# EasyEDA Pro project minSTMc8t6.eprj

# Schematic Schematic1
Create Date: 2024-05-14; Page Name: P1; Project Name: M.2_minSTMc8t6; Schematic Name: Schematic1; Update Date: 2024-05-14; Company: 嘉立创EDA; Page Size: A3; Version: V1.0
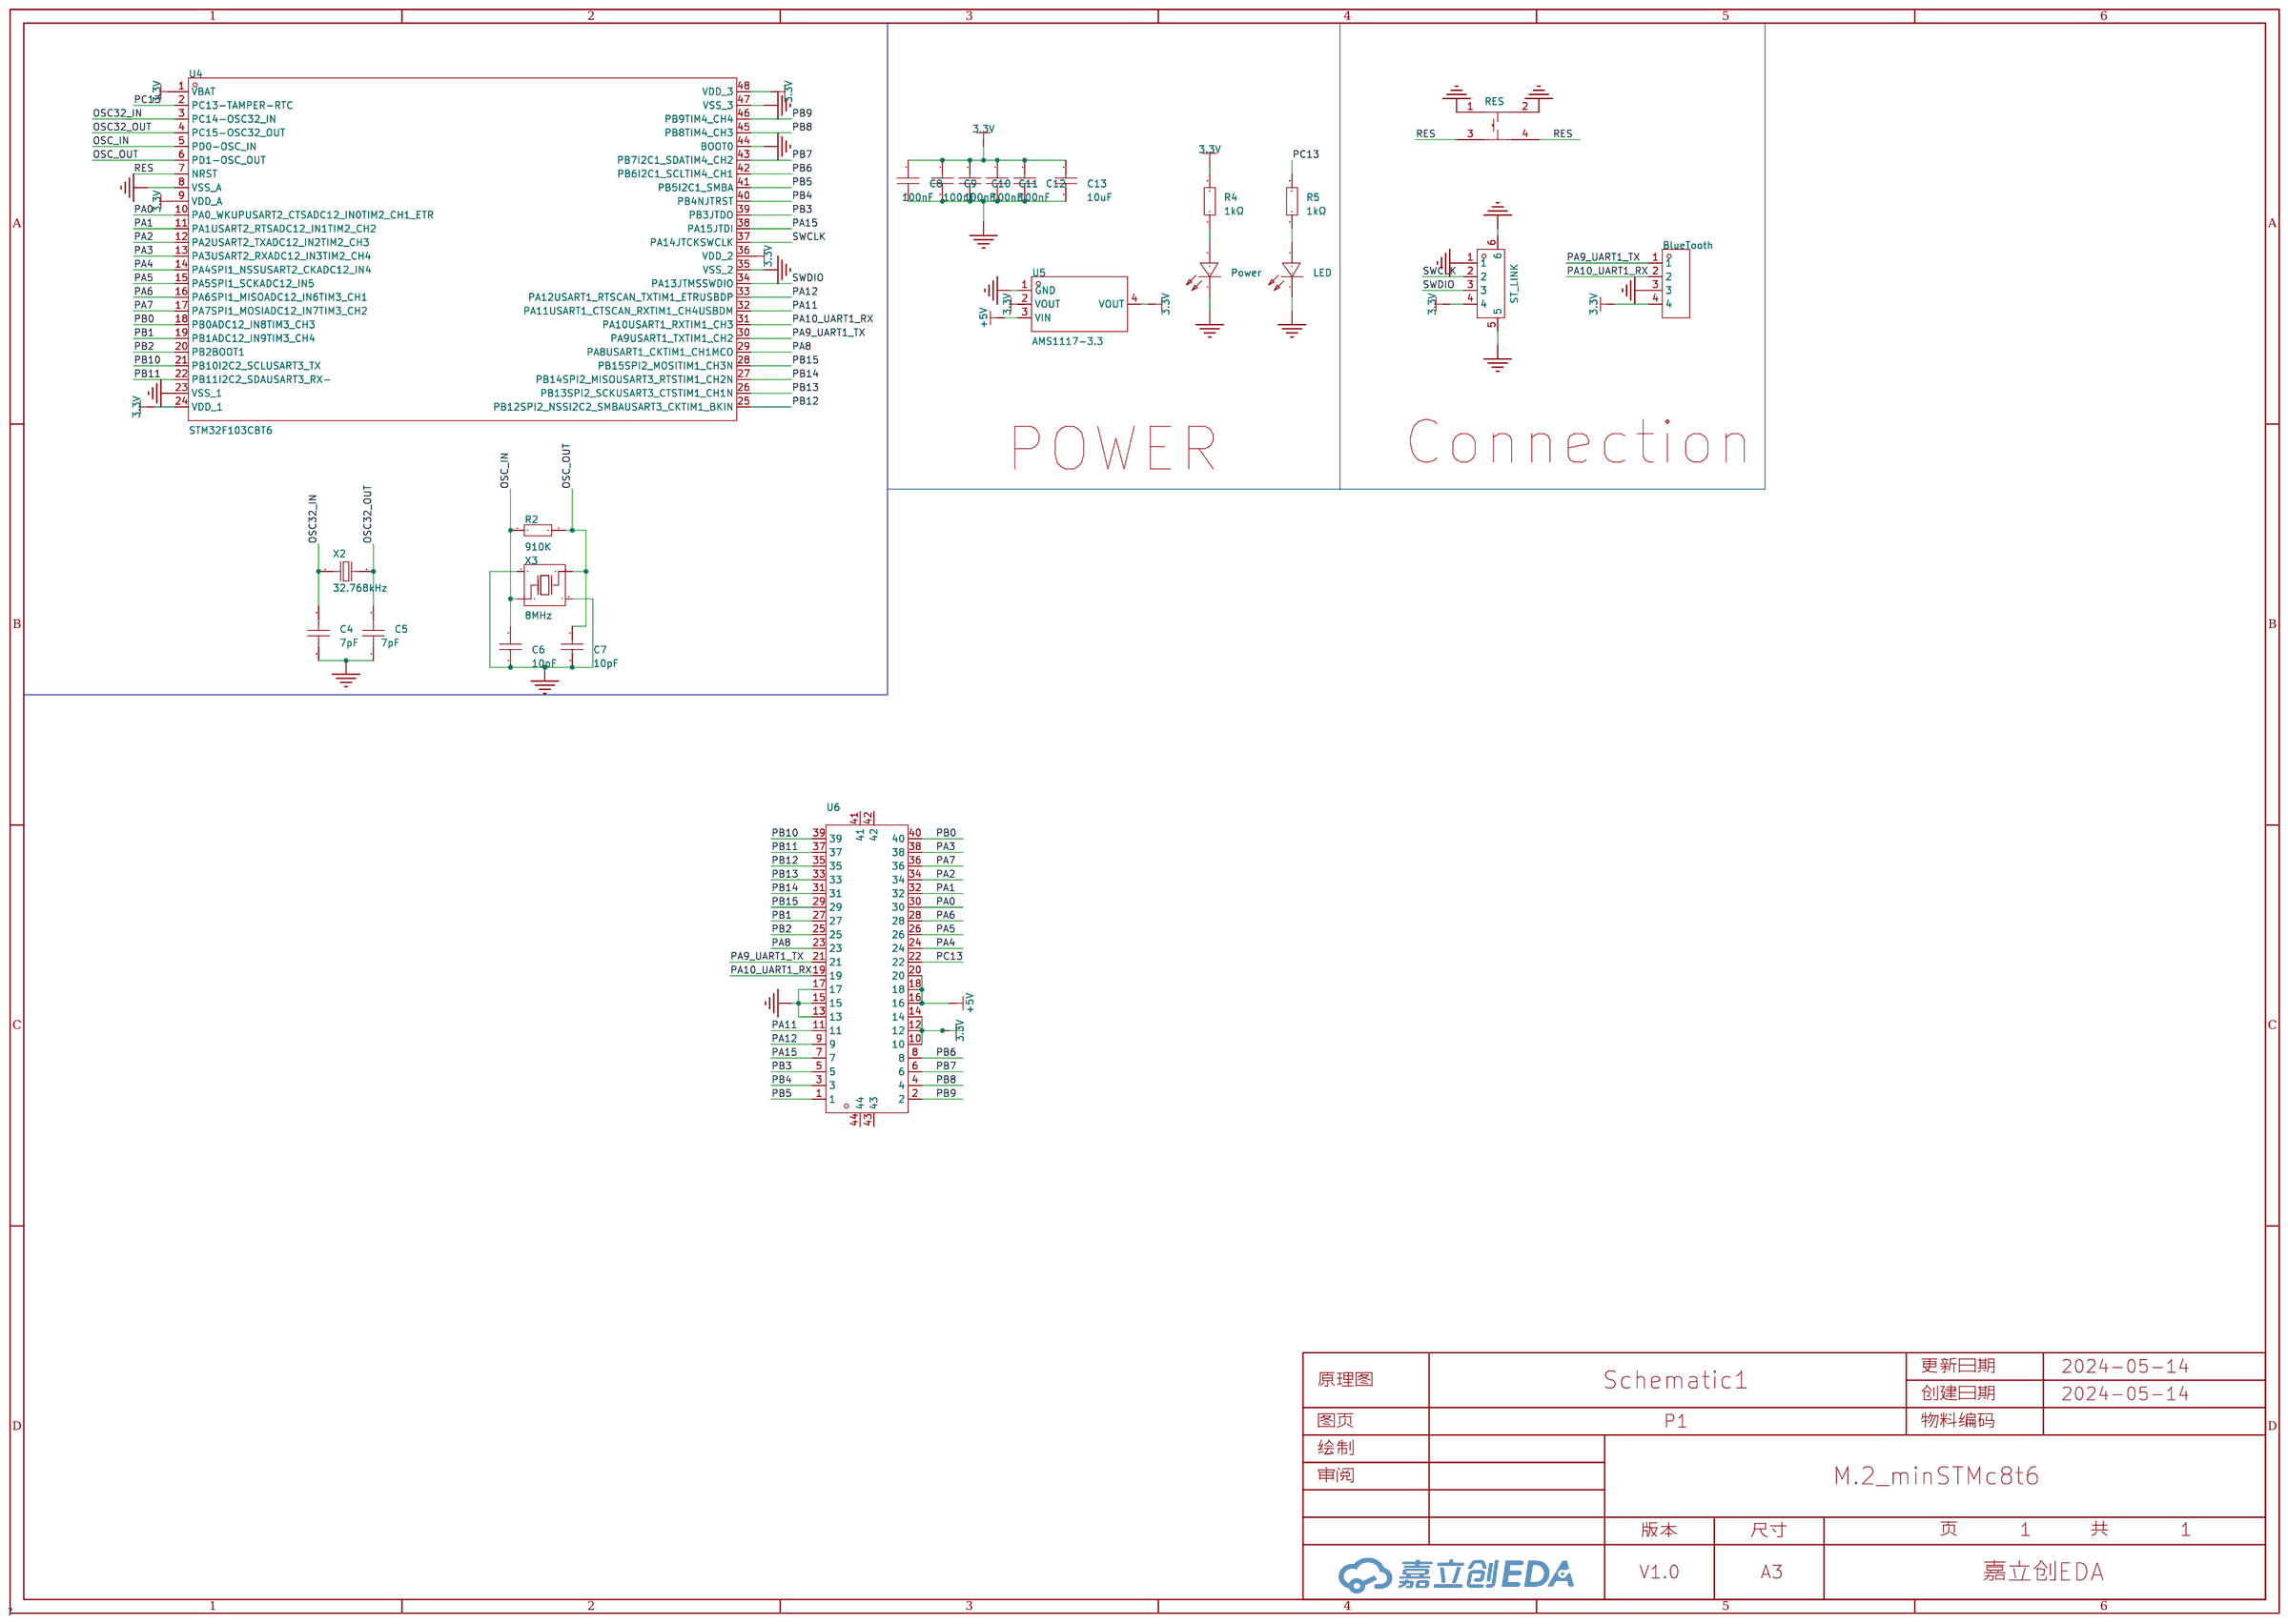
[diagram p0: schematic sheet]

## Parts
BlueTooth  2.54-1*4P母  [HDR-TH_4P-P2.54-V-F]
C4  7pF  [C0402]
C5  7pF  [C0402]
C6  10pF  [C0402]
C7  10pF  [C0402]
C8  100nF  [C0402]
C9  100nF  [C0402]
C10  100nF  [C0402]
C11  100nF  [C0402]
C12  100nF  [C0402]
C13  10uF  [C0402]
LED  NCD0402R1  [LED0402-RD]
Power  NCD0402R1  [LED0402-RD]
R2  910K  [R0603]
R4  1kΩ  [R0402]
R5  1kΩ  [R0402]
RES  K2-1808SN-A3SW-01  [SW-SMD_4P-L4.2-W3.3-P2.15-LS5.1]
ST_LINK  HDGC1251WR-S-4P  [CONN-SMD_4P-P1.25_HDGC-HDGC1251WR-S-4P]
U4  STM32F103CBT6  [LQFP-48_L7.0-W7.0-P0.50-LS9.0-BL]
U5  AMS1117-3.3  [SOT-223-3_L6.5-W3.4-P2.30-LS7.0-BR]
U6  HC-PBB40C-40DP-0.4V-02  [CONN-SMD_40P-P0.40_HCTL_HC-PBB40C-40DP-0.4V-02]
X2  32.768kHz  [FC-135R_L3.2-W1.5]
X3  8MHz  [OSC-SMD_4P-L3.2-W2.5-BL]

## Library data of the parts
BlueTooth = 2.54-1*4P母: 插孔结构:1x4P;间距:2.54mm;行距:-;圆孔/方孔:方孔;安装类型:直插;排数:单排;总孔位数:4P;额定电流:3A;额定电压:-;插孔方向:顶部;塑高:-;触头材质:青铜;触头镀层:-;工作温度范围:-40℃~+105℃;焊接温度(最大值):-;; LCSC Part Name: 间距:2.54mm 1x4P 直插; Supplier Part: C2718488; Manufacturer: BOOMELE(博穆精密); Supplier Footprint: 插件,P=2.54mm; JLCPCB Part Class: 扩展库; Datasheet: https://atta.szlcsc.com/upload/public/pdf/source/20210301/C2718488_F4427B881E42CAA8DDB0B1C12B3A522C.pdf; Supplier: LCSC; Holes Structure: 1x4P; Pitch: 2.54mm; Circular Hole / Square Hole: 方孔; Mounting Type: 直插; Number of Rows: 单排; Number of Holes: 4P; Current Rating (Max): 3A; Holes Direction: 顶部; Contact Material: 青铜; Operating Temperature Range: -40℃~+105℃
C4 C5 = CC0402BRNPO9BN7R0: 容值:7pF;额定电压:50V;材质(温度系数):NP0;; LCSC Part Name: 7pF 50V; Supplier Part: C541343; Manufacturer: YAGEO(国巨); Supplier Footprint: 0402; JLCPCB Part Class: 扩展库; Datasheet: https://atta.szlcsc.com/upload/public/pdf/source/20200615/C541343_829EF09E97ECA25D4EF5AFDE43440985.pdf; Supplier: LCSC; Voltage Rated: 50V; Temperature Coefficient: NP0
C6 C7 = CC0402JRNPO9BN100: 容值:10pF;精度:±5%;额定电压:50V;材质(温度系数):NP0;; LCSC Part Name: 10pF ±5% 50V; Supplier Part: C106199; Manufacturer: YAGEO(国巨); Supplier Footprint: 0402; JLCPCB Part Class: Extended Part; Datasheet: https://atta.szlcsc.com/upload/public/pdf/source/20181008/C309499_21CC21451B82C39E3D92150FD6B30293.pdf; Supplier: LCSC; Tolerance: ±5%; Voltage Rated: 50V; Temperature Coefficient: NP0
C8-C12 = CL05B104KO5NNNC: 容值:100nF;精度:±10%;额定电压:16V;材质(温度系数):X7R;; LCSC Part Name: 100nF ±10% 16V; Supplier Part: C1525; Manufacturer: SAMSUNG(三星); Supplier Footprint: 0402; JLCPCB Part Class: 基础库; Datasheet: https://atta.szlcsc.com/upload/public/pdf/source/20160218/1457707763339.pdf; Supplier: LCSC; Tolerance: ±10%; Voltage Rated: 16V; Temperature Coefficient: X7R
C13 = CL05A106MQ5NUNC: 容值:10uF;精度:±20%;额定电压:6.3V;材质(温度系数):X5R;; LCSC Part Name: 10uF ±20% 6.3V; Supplier Part: C15525; Manufacturer: SAMSUNG(三星); Supplier Footprint: 0402; JLCPCB Part Class: Basic Part; Datasheet: https://atta.szlcsc.com/upload/public/pdf/source/20220823/2B02EE04F8F211D38A52DCB16EB6BEBA.pdf; Supplier: LCSC; Tolerance: ±20%; Voltage Rated: 6.3V; Temperature Coefficient: X5R
LED Power = NCD0402R1: 发光颜色:红色;正向电压(VF):1.6V~2.6V;功率:65mW;正向电流:5mA;主波长:615nm~635nm;透镜颜色:无色透明透镜;发光强度:13mcd~30mcd;发光角度:130°;工作温度:-30℃~+85℃;; Supplier Part: C130719; Manufacturer: 国星光电; Supplier Footprint: 0402; JLCPCB Part Class: Extended Part; Datasheet: https://atta.szlcsc.com/upload/public/pdf/source/20200820/C130719_A72EA5A7FEC83C35856EA0453E4EE775.pdf; Supplier: LCSC; Emitted Color: 红色; Forward Voltage (VF): 1.6V~2.6V; Power Dissipation: 65mW; Forward Current: 5mA; Dominant Wavelength: 615nm~635nm; Lens Color: 无色透明透镜; Luminous Intensity: 13mcd~30mcd; Viewing Angle: 130°; Operating Temperature: -30℃~+85℃
R2 = Res_0603: Supplier Footprint: 0603
R4 R5 = 0402WGF1001TCE: 电阻类型:厚膜电阻;阻值:1kΩ;精度:±1%;功率:62.5mW;最大工作电压:50V;温度系数:±100ppm/℃;; LCSC Part Name: 1kΩ ±1% 62.5mW 厚膜电阻; Supplier Part: C11702; Manufacturer: UNI-ROYAL(厚声); Supplier Footprint: 0402; JLCPCB Part Class: 基础库; Datasheet: https://atta.szlcsc.com/upload/public/pdf/source/20200306/C422600_1E6D84923E4A46A82E41ADD87F860B5C.pdf; Supplier: LCSC; Type: 厚膜电阻; Tolerance: ±1%; Power(Watts): 62.5mW; Overload Voltage (Max): 50V; Temperature Coefficient: ±100ppm/℃; Operating Temperature Range: -55℃~+155℃
RES = K2-1808SN-A3SW-01: 作用力:180gf;安装方式:立贴;开关长度:4.2mm;开关宽度:3.25mm;开关高度:2.5mm;触点电流:50mA;额定电压(DC):12V;绝缘电阻:100MΩ;机械寿命:10万次;; LCSC Part Name: 3*4*2.5 贴片开关180G; Supplier Part: C2690012; Manufacturer: 韩国韩荣; Supplier Footprint: SMD; JLCPCB Part Class: 扩展库; Datasheet: https://atta.szlcsc.com/upload/public/pdf/source/20180927/C283535_7E7907F3E7B6C1691E1DC87E363D082A.pdf; Supplier: LCSC; Operating Force: 180gf; Mounting Style: 立贴; Switch Length: 4.2mm; Switch Width: 3.25mm; Switch Height: 2.5mm; Contact Current: 50mA; Voltage Rating (DC): 12V; Insulation Resistance: 100MΩ; Mechanical Life: 10万次; Operating Temperature: -25℃~+85℃
ST_LINK = HDGC1251WR-S-4P: 插针结构:1x4P;间距:1.25mm;安装方式:卧贴;参考系列:-;总PIN数:4P;排数:1;每排PIN数:4;行距:-;额定电流:1A;工作温度范围:-25℃~+70℃;; LCSC Part Name: 1x4P 间距:1.25mm 卧贴; Supplier Part: C2936205; Manufacturer: HDGC(华德共创); Supplier Footprint: SMD,P=1.25mm,卧贴; JLCPCB Part Class: 扩展库; Datasheet: https://atta.szlcsc.com/upload/public/pdf/source/20211224/39B2CD9909BA84C441A1A286C5C28FE5.pdf; Supplier: LCSC; Pins Structure: 1x4P; Pitch: 1.25mm; Mounting Style: 卧贴; Number of Pins: 4P; Number of Rows: 1; Number of PINs Per Row: 4; Current Rating (Max): 1A; Operating Temperature Range: -25℃~+70℃
U4 = STM32F103CBT6: CPU内核:CM3;程序存储容量:128KB;RAM总容量:20KB;GPIO端口数量:37;工作电压范围:2V~3.6V;CPU最大主频:72MHz;程序存储器类型:FLASH;; Supplier Part: C8304; Manufacturer: ST(意法半导体); Supplier Footprint: LQFP-48(7x7); JLCPCB Part Class: 扩展库; Datasheet: https://atta.szlcsc.com/upload/public/pdf/source/20150811/1457707344439.pdf; Supplier: LCSC; CPU Core: CM3; Program Storage Size: 128KB; RAM Size: 20KB; GPIO Ports Number: 37; Operating Voltage Range: 2V~3.6V; CPU Maximum Speed: 72MHz; Program Memory Type: FLASH; Operating Temperature Range: -40℃~+85℃; ADC (Bit): 12bit; Universal Serial Bus: 有; Peripheral/Function: DMA；片载温度传感器；PWM; Watchdog: 有; Infrared Data Association: 有; Low-Voltage Detect: 有; Direct Memory Access: 有; Internal Oscillator: 有; Check: true
U5 = AMS1117-3.3_C6186: 输出类型:固定;最大输入电压:-;输出电压:3.3V;最大输出电流:1A;电源纹波抑制比(PSRR):72dB@(120Hz);输出极性:正极;; LCSC Part Name: 输出3.3V 1A; Supplier Part: C6186; Manufacturer: AMS; Supplier Footprint: SOT-223-3; JLCPCB Part Class: 基础库; Datasheet: https://atta.szlcsc.com/upload/public/pdf/source/20180727/C6186_7A095716F0823C02F1997A905E26C086.pdf; Supplier: LCSC; Output Type: 固定; Output Voltage: 3.3V; MAX Output Current: 1A; Power Supply Rejection Ratio (PSRR): 72dB@(120Hz); Dropout Voltage: 1.3V@(800mA); Output Polarity: 正极; Number of Outputs: 1
U6 = HC-PBB40C-40DP-0.4V-02: PIN总数:40P;间距:0.4mm;公母:公;安装方式:立贴;行数:2;额定电流:300mA;工作温度范围:-35℃~+85℃;; LCSC Part Name: PIN:40P 间距:0.4mm 公 立贴; Supplier Part: C19089232; Manufacturer: HCTL(华灿天禄); Supplier Footprint: SMD,P=0.4mm; JLCPCB Part Class: 扩展库; Datasheet: https://atta.szlcsc.com/upload/public/pdf/source/20231026/4BDE2190AA6E7694F187A7FBDCD76BE9.pdf; Supplier: LCSC; Number of Pins: 40P; Pitch: 0.4mm; Gender: 公; Mounting Style: 立贴; Number of Rows: 2; Current Rating (Max): 300mA; Contact Material: 磷青铜; Operating Temperature Range: -35℃~+85℃
X2 = Q13FC13500004_C32346: 晶振类型:贴片晶振;频率:32.768kHz;常温频差:±20ppm;外接负载电容:12.5pF;; LCSC Part Name: 32.768kHz ±20ppm 12.5pF; Supplier Part: C32346; Manufacturer: EPSON(爱普生); Manufacturer Part: Q13FC13500004; Supplier Footprint: SMD3215-2P; JLCPCB Part Class: 基础库; Datasheet: https://atta.szlcsc.com/upload/public/pdf/source/20240418/0E0FF5F0356BA3753F616001439D1416.pdf; Supplier: LCSC; Crystal Type: 贴片晶振; Normal temperature Frequency Tolerance: ±20ppm; External load capacitor: 12.5pF; Equivalent Series Resistance (ESR): 70kΩ; Operating Temperature: -40℃~+85℃
X3 = TAXM8M4RDBCCT2T: 晶振类型:贴片晶振;频率:8MHz;常温频差:±10ppm;外接负载电容:10pF;频率稳定度(全温):±15ppm;; LCSC Part Name: 8MHz ±10ppm 10pF; Supplier Part: C400090; Manufacturer: YJX(雅晶鑫); Supplier Footprint: SMD3225-4P; JLCPCB Part Class: 扩展库; Datasheet: https://atta.szlcsc.com/upload/public/pdf/source/20190626/C400090_CF95B89E745AFE4EF2E392EF8AC009D6.pdf; Supplier: LCSC; Crystal Type: 贴片晶振; Normal temperature Frequency Tolerance: ±10ppm; External load capacitor: 10pF; Frequency Stability(Full temperature range): ±15ppm; Equivalent Series Resistance (ESR): 250Ω; Operating Temperature: -40℃~+85℃

## Nets
3.3V: BlueTooth.4 C8.2 C9.2 C10.2 C11.2 C12.2 C13.2 R4.2 ST_LINK.4 U4.1(VBAT) U4.9(VDD_A) U4.24(VDD_1) U4.36(VDD_2) U4.48(VDD_3) U5.2(VOUT) U5.4(VOUT) U6.10 U6.12 U6.14
+5V: U5.3(VIN) U6.16 U6.18 U6.20
GND: BlueTooth.3 C4.1 C5.1 C6.1 C7.1 C8.1 C9.1 C10.1 C11.1 C12.1 C13.1 LED.1(K) Power.1(K) RES.1 RES.2 ST_LINK.1 ST_LINK.5 ST_LINK.6 U4.8(VSS_A) U4.23(VSS_1) U4.35(VSS_2) U4.44(BOOT0) U4.47(VSS_3) U5.1(GND) U6.13 U6.15 U6.17 X3.2 X3.4
OSC32_IN: C4.2 U4.3(PC14-OSC32_IN) X2.1
OSC32_OUT: C5.2 U4.4(PC15-OSC32_OUT) X2.2
OSC_IN: C6.2 R2.1 U4.5(PD0-OSC_IN) X3.1
OSC_OUT: C7.2 R2.2 U4.6(PD1-OSC_OUT) X3.3
PA0: U4.10(PA0_WKUPUSART2_CTSADC12_IN0TIM2_CH1_ETR) U6.30
PA1: U4.11(PA1USART2_RTSADC12_IN1TIM2_CH2) U6.32
PA2: U4.12(PA2USART2_TXADC12_IN2TIM2_CH3) U6.34
PA3: U4.13(PA3USART2_RXADC12_IN3TIM2_CH4) U6.38
PA4: U4.14(PA4SPI1_NSSUSART2_CKADC12_IN4) U6.24
PA5: U4.15(PA5SPI1_SCKADC12_IN5) U6.26
PA6: U4.16(PA6SPI1_MISOADC12_IN6TIM3_CH1) U6.28
PA7: U4.17(PA7SPI1_MOSIADC12_IN7TIM3_CH2) U6.36
PA8: U4.29(PA8USART1_CKTIM1_CH1MCO) U6.23
PA9_UART1_TX: BlueTooth.1 U4.30(PA9USART1_TXTIM1_CH2) U6.21
PA10_UART1_RX: BlueTooth.2 U4.31(PA10USART1_RXTIM1_CH3) U6.19
PA11: U4.32(PA11USART1_CTSCAN_RXTIM1_CH4USBDM) U6.11
PA12: U4.33(PA12USART1_RTSCAN_TXTIM1_ETRUSBDP) U6.9
PA15: U4.38(PA15JTDI) U6.7
PB0: U4.18(PB0ADC12_IN8TIM3_CH3) U6.40
PB1: U4.19(PB1ADC12_IN9TIM3_CH4) U6.27
PB2: U4.20(PB2BOOT1) U6.25
PB3: U4.39(PB3JTDO) U6.5
PB4: U4.40(PB4NJTRST) U6.3
PB5: U4.41(PB5I2C1_SMBA) U6.1
PB6: U4.42(PB6I2C1_SCLTIM4_CH1) U6.8
PB7: U4.43(PB7I2C1_SDATIM4_CH2) U6.6
PB8: U4.45(PB8TIM4_CH3) U6.4
PB9: U4.46(PB9TIM4_CH4) U6.2
PB10: U4.21(PB10I2C2_SCLUSART3_TX) U6.39
PB11: U4.22(PB11I2C2_SDAUSART3_RX-) U6.37
PB12: U4.25(PB12SPI2_NSSI2C2_SMBAUSART3_CKTIM1_BKIN) U6.35
PB13: U4.26(PB13SPI2_SCKUSART3_CTSTIM1_CH1N) U6.33
PB14: U4.27(PB14SPI2_MISOUSART3_RTSTIM1_CH2N) U6.31
PB15: U4.28(PB15SPI2_MOSITIM1_CH3N) U6.29
PC13: R5.2 U4.2(PC13-TAMPER-RTC) U6.22
RES: RES.3 RES.4 U4.7(NRST)
SWCLK: ST_LINK.2 U4.37(PA14JTCKSWCLK)
SWDIO: ST_LINK.3 U4.34(PA13JTMSSWDIO)
$1N3567: Power.2(A) R4.1
$1N4136: LED.2(A) R5.1

Not connected (* = marked no-connect by the designer): U6 41 42 43 44

## Notes on the sheet
- Connection
- POWER

# Board PCB1
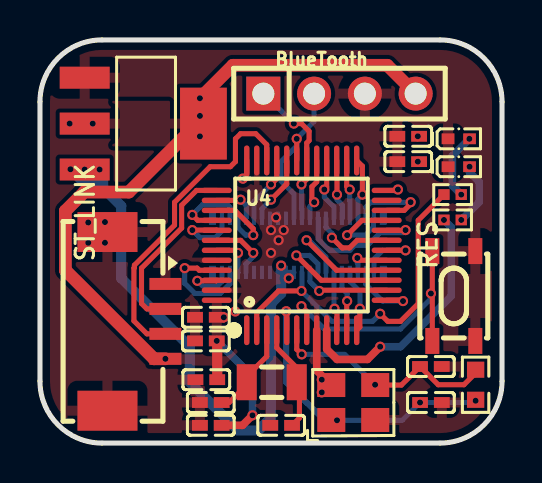
[diagram p1: board, top side]
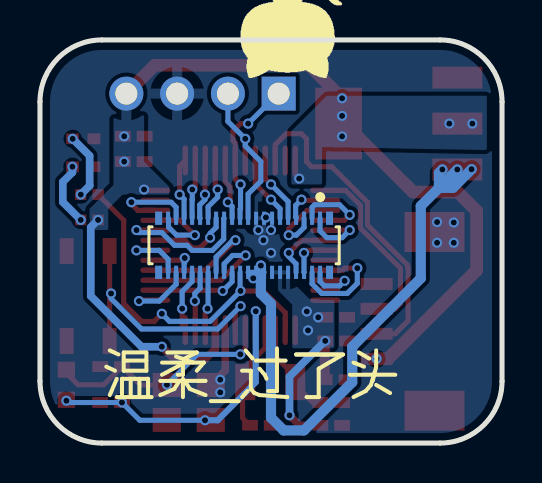
[diagram p2: board, bottom side, seen from below]

Outline 23.11 x 20.19 mm; copper layers: Top Layer, Bottom Layer. Coordinates in mm from the lower left corner of the outline.
Outline path: 0,17.09 0,3.1 arc(0.91,0.91) 3.1,0 20.01,0 arc(22.21,0.91) 23.11,3.1 23.11,17.09 arc(22.21,19.29) 20.01,20.19 3.1,20.19 arc(0.91,19.29) 0,17.09
Stack: Top Layer 0.035mm / Dielectric1 1.51mm FR4 er 4.5 / Bottom Layer 0.035mm

## Design rules (mm)
template: 自定义配置
spacing copperThickness1oz (default): track to track 0.102, other pairs 0.152 to 0.3
spacing copperThickness2oz: track to track 0.203, other pairs 0.152 to 0.3
track width copperThickness1oz (default): min 0.127, default 0.254, max 2.54
track width copperThickness2oz: min 0.203, default 0.254, max 2.54
differential pair differentialPair (default): width min 0.127, default 0.254, max 2.54; gap min 0.152, default 0.152
via viaSize (default): diameter min 0.5, default 0.61, max 10; hole min 0.3, default 0.305, max 6.3

## Placement (name value [footprint] x y rotation side)
BlueTooth  2.54-1*4P母  [HDR-TH_4P-P2.54-V-F]  14.98 17.5 0 top
C4  7pF  [C0402]  8.54 2.03 0 top
C5  7pF  [C0402]  12.06 0.89 0 top
C6  10pF  [C0402]  19.56 2.03 180 top
C7  10pF  [C0402]  19.56 3.83 180 top
C8  100nF  [C0402]  8.32 3.18 0 top
C9  100nF  [C0402]  8.3 6.3 0 top
C10  100nF  [C0402]  8.3 5.12 0 top
C11  100nF  [C0402]  8.54 0.89 0 top
C12  100nF  [C0402]  18.42 14.1 0 top
C13  10uF  [C0402]  18.42 15.37 0 top
LED  NCD0402R1  [LED0402-RD]  20.95 15.24 0 top
Power  NCD0402R1  [LED0402-RD]  20.95 13.84 0 top
R2  910K  [R0603]  21.79 2.92 90 top
R4  1kΩ  [R0402]  20.64 11.18 180 top
R5  1kΩ  [R0402]  20.64 12.45 180 top
RES  K2-1808SN-A3SW-01  [SW-SMD_4P-L4.2-W3.3-P2.15-LS5.1]  20.7 7.37 270 top
ST_LINK  HDGC1251WR-S-4P  [CONN-SMD_4P-P1.25_HDGC-HDGC1251WR-S-4P]  4.83 6.1 270 top
U4  STM32F103CBT6  [LQFP-48_L7.0-W7.0-P0.50-LS9.0-BL]  13.09 9.91 0 top
U5  AMS1117-3.3  [SOT-223-3_L6.5-W3.4-P2.30-LS7.0-BR]  5.21 16 180 top
U6  HC-PBB40C-40DP-0.4V-02  [CONN-SMD_40P-P0.40_HCTL_HC-PBB40C-40DP-0.4V-02]  12.9 9.91 0 bottom
X2  32.768kHz  [FC-135R_L3.2-W1.5]  11.59 3.05 0 top
X3  8MHz  [OSC-SMD_4P-L3.2-W2.5-BL]  15.67 2.03 0 top

## Footprints (pads in the part's own frame, mm; a bottom-side part is the same pattern mirrored in y, then rotated)
C0402
  rect 0.79x0.54 smd: 1(-0.545,0) 2(0.545,0)
CONN-SMD_4P-P1.25_HDGC-HDGC1251WR-S-4P
  rect 0.6x1.6 smd: 1(-1.875,1.45) 2(-0.625,1.45) 3(0.625,1.45) 4(1.875,1.45)
  rect 2x3 smd: 5(4.475,-1.45) 6(-4.475,-1.45)
CONN-SMD_40P-P0.40_HCTL_HC-PBB40C-40DP-0.4V-02
  rect 0.2x0.66 smd: 1(-3.8,-1.355) 2(-3.8,1.355) 3(-3.4,-1.355) 4(-3.4,1.355) 5(-3,-1.355) 6(-3,1.355) 7(-2.6,-1.355) 8(-2.6,1.355) 9(-2.2,-1.355) 10(-2.2,1.355) 11(-1.8,-1.355) 12(-1.8,1.355) 13(-1.4,-1.355) 14(-1.4,1.355) 15(-1,-1.355) 16(-1,1.355) 17(-0.6,-1.355) 18(-0.6,1.355) 19(-0.2,-1.355) 20(-0.2,1.355) 21(0.2,-1.355) 22(0.2,1.355) 23(0.6,-1.355) 24(0.6,1.355) 25(1,-1.355) 26(1,1.355) 27(1.4,-1.355) 28(1.4,1.355) 29(1.8,-1.355) 30(1.8,1.355) 31(2.2,-1.355) 32(2.2,1.355) 33(2.6,-1.355) 34(2.6,1.355) 35(3,-1.355) 36(3,1.355) 37(3.4,-1.355) 38(3.4,1.355) 39(3.8,-1.355) 40(3.8,1.355)
  rect 0.35x0.66 smd: 41(4.275,-1.355) 42(4.275,1.355) 43(-4.275,1.355) 44(-4.275,-1.355)
FC-135R_L3.2-W1.5
  rect 1x1.8 smd: 1(-1.25,0) 2(1.25,0)
HDR-TH_4P-P2.54-V-F
  rect 1.7x1.7 hole 1.1: 1(-3.81,0)
  round 1.7 hole 1.1: 2(-1.27,0) 3(1.27,0) 4(3.81,0)
LED0402-RD
  rect 0.636x0.54 smd: 1(-0.538,0) 2(0.538,0)
LQFP-48_L7.0-W7.0-P0.50-LS9.0-BL
  oval 0.27x1.5 smd: 1(-2.75,-4.25) 2(-2.25,-4.25) 3(-1.75,-4.25) 4(-1.25,-4.25) 5(-0.75,-4.25) 6(-0.25,-4.25) 7(0.25,-4.25) 8(0.75,-4.25) 9(1.25,-4.25) 10(1.75,-4.25) 11(2.25,-4.25) 12(2.75,-4.25) 25(2.75,4.25) 26(2.25,4.25) 27(1.75,4.25) 28(1.25,4.25) 29(0.75,4.25) 30(0.25,4.25) 31(-0.25,4.25) 32(-0.75,4.25) 33(-1.25,4.25) 34(-1.75,4.25) 35(-2.25,4.25) 36(-2.75,4.25)
  oval 1.5x0.27 smd: 13(4.25,-2.75) 14(4.25,-2.25) 15(4.25,-1.75) 16(4.25,-1.25) 17(4.25,-0.75) 18(4.25,-0.25) 19(4.25,0.25) 20(4.25,0.75) 21(4.25,1.25) 22(4.25,1.75) 23(4.25,2.25) 24(4.25,2.75) 37(-4.25,2.75) 38(-4.25,2.25) 39(-4.25,1.75) 40(-4.25,1.25) 41(-4.25,0.75) 42(-4.25,0.25) 43(-4.25,-0.25) 44(-4.25,-0.75) 45(-4.25,-1.25) 46(-4.25,-1.75) 47(-4.25,-2.25) 48(-4.25,-2.75)
OSC-SMD_4P-L3.2-W2.5-BL
  rect 1.4x1.2 smd: 1(-1.1,-0.875) 2(1.1,-0.875) 3(1.1,0.875) 4(-1.1,0.875)
R0402
  rect 0.566x0.54 smd: 1(-0.433,0) 2(0.433,0)
R0603
  rect 0.806x0.864 smd: 1(-0.753,0) 2(0.753,0)
SOT-223-3_L6.5-W3.4-P2.30-LS7.0-BR
  rect 2.5x1.1 smd: 1(2.97,-2.3) 2(2.97,0) 3(2.97,2.3)
  rect 2.34x3.6 smd: 4(-2.97,0)
SW-SMD_4P-L4.2-W3.3-P2.15-LS5.1
  rect 1.3x0.7 smd: 1(-2.25,1.075) 2(2.25,1.075) 3(-2.25,-1.075) 4(2.25,-1.075)

## Nets
As in the schematic.

Pads without a net: U6 41 42 43 44

## Via types
v1: diameter 0.508, hole 0.305, Top Layer to Bottom Layer, 78 vias

## Routing (per net, layer and track width the routed paths; a pad name or vN(x,y) marks a point on that pad's centre or on a via; arc(x,y) is an arc through that point)
3.3V: length 52.4
  Top Layer w0.254: v1(10.15,13.25) 10.34,13.44 U4.36
  Top Layer w0.381: v1(10.63,1.39) 10.13,0.89 C11.2 ; 14.34,5.66 14.34,4.71 14.86,4.19 16.38,4.19 v1(17.02,4.83)
  Top Layer w0.508: C8.2 8.87,5.1 v1(8.84,5.12)
  Top Layer w0.635: v1(8,17.27) 9.65,18.92 17.37,18.92 BlueTooth.4 ; v1(6.28,4.22) 5.7,4.22 1.27,8.66 1.27,11.63 2.21,12.57 4.44,12.57 7.87,16 U5.4
  Bottom Layer w0.381: v1(17.02,4.83) 18.03,4.83 20.57,7.37 20.57,10.81 v1(20.21,11.18) ; v1(10.63,1.39) 10.63,3.33 v1(8.84,5.12)
  vias: v1(1.48,16) v1(2.64,16) v1(8,16.39) v1(8,15.36) v1(9.2,6.3) v1(9.7,5.65) v1(9.77,6.59) v1(17.91,12.7) v1(18.9,15.37) v1(18.9,14.1)
+5V: length 29.8
  Bottom Layer w0.254: U6.20 U6.18 U6.16
  Bottom Layer w0.508: v1(1.52,13.72) 2.46,12.78 3.16,12.78 ; v1(2.98,13.7) 3.16,13.53 3.16,12.78 ; 3.16,12.78 4.06,11.88 4.06,8.26 7.49,4.83 7.49,3.05 9.91,0.64 10.92,0.64 11.56,1.27 11.56,6.98 12.06,7.49 v1(12.06,8.89) ; 3.16,12.78 v1(2.24,13.7)
  vias: v1(12.45,8.26)
GND: length 3.1
  Top Layer w0.381: X3.4 13.84,3.64 U4.8
  vias: v1(2.41,11.05) v1(2.41,10.03) v1(3.25,11.07) v1(3.25,10.03) v1(11.56,10.67) v1(11.56,9.53) v1(11.81,11.3) v1(11.94,10.16) v1(12.19,10.67) v1(14.1,3.18) v1(14.1,2.54)
OSC32_IN: length 4.2
  Top Layer w0.254: 10.48,3.05 9.46,2.03 C4.2 ; U4.3 11.34,4.34 10.56,3.56
OSC32_OUT: length 4.9
  Top Layer w0.254: C5.2 12.98,1.26 12.98,3.05 ; 13.06,3.56 11.84,4.77 U4.4
OSC_IN: length 15.2
  Top Layer w0.254: U4.5 12.34,6.58 v1(12.32,6.6)
  Bottom Layer w0.254: v1(14.86,1.14) 18.12,1.14 v1(19.01,2.03) 21.7,2.03 v1(21.79,2.12)
  Bottom Layer w0.305: v1(12.32,6.6) 12.32,3.05 14.22,1.14 v1(14.86,1.14)
OSC_OUT: length 11.8
  Top Layer w0.254: X3.3 18.08,2.91 19.01,3.83 19.92,2.92 21.21,2.92 21.79,3.51 R2.2 ; U4.6 12.84,4.7 v1(13.09,4.45)
  Bottom Layer w0.254: v1(16.76,2.92) 15.24,4.45 v1(13.09,4.45)
PA0: length 2.7
  Top Layer w0.254: 14.86,6.48 14.86,5.67 U4.10
  Bottom Layer w0.254: U6.30 14.7,6.76 v1(14.73,6.73)
PA1: length 3
  Top Layer w0.254: 15.34,5.66 15.34,7.09 v1(15.37,7.11)
  Bottom Layer w0.254: U6.32 15.1,7.76 15.37,7.49 v1(15.37,7.11)
PA2: length 3.2
  Top Layer w0.254: U4.12 16,5.81 v1(16,6.73)
  Bottom Layer w0.254: U6.34 15.5,8.09 16,7.59 v1(16,6.73)
PA3: length 3.6
  Top Layer w0.254: v1(18.16,7.11) 18.12,7.16 17.34,7.16
  Bottom Layer w0.254: v1(18.16,7.11) 17.14,7.11 16.3,7.95 U6.38
PA4: length 4.5
  Top Layer w0.254: 17.34,7.66 14.01,7.66 v1(13.97,7.62)
  Bottom Layer w0.254: v1(13.97,7.62) 13.5,8.09 U6.24
PA5: length 6.7
  Top Layer w0.254: v1(12.83,9.4) 14.07,8.16 17.34,8.16
  Bottom Layer w0.254: v1(12.83,9.4) 13.48,9.4 13.9,8.98 U6.26
PA6: length 6.7
  Top Layer w0.254: 17.34,8.66 14.84,8.66 v1(13.33,10.16)
  Bottom Layer w0.254: v1(13.33,10.16) 13.46,10.16 14.3,9.32 U6.28
PA7: length 2.2
  Top Layer w0.254: v1(15.88,9.27) 15.99,9.16 17.34,9.16
  Bottom Layer w0.254: v1(15.88,9.27) 15.88,9.04 15.9,9.01 U6.36
PA8: length 3.1
  Top Layer w0.254: v1(13.72,12.06) 13.6,12.18 13.6,12.84 13.84,13.08 U4.29
  Bottom Layer w0.254: U6.23 13.5,11.85 v1(13.72,12.06)
PA9_UART1_TX: length 7.6
  Top Layer w0.254: v1(13.08,12.95) 13.34,13.22 U4.30 13.34,15.03 13.46,15.15 13.46,15.62 13.08,16 v1(12.7,16)
  Bottom Layer w0.254: v1(12.7,16) 11.2,17.5 BlueTooth.1 ; v1(13.08,12.95) 13.08,11.74 13.1,11.72 U6.21
PA10_UART1_RX: length 8.3
  Top Layer w0.254: U4.31 v1(12.84,15.24)
  Bottom Layer w0.254: BlueTooth.2 13.71,16.11 v1(12.84,15.24) 12.84,14.88 12.06,14.1 12.06,13.12 12.7,12.48 U6.19
PA11: length 3.4
  Top Layer w0.254: v1(11.56,12.19) 12.34,12.98 U4.32
  Bottom Layer w0.254: U6.11 11.1,11.74 v1(11.56,12.19)
PA12: length 3.4
  Top Layer w0.254: U4.33 11.84,13.24 v1(11.56,12.95)
  Bottom Layer w0.254: U6.9 10.7,12.1 v1(11.56,12.95)
PA15: length 2.3
  Top Layer w0.254: U4.38 10,12.16 v1(10.03,12.19)
  Bottom Layer w0.254: 10.29,11.28 10.32,11.31 10.32,11.9 v1(10.03,12.19)
PB0: length 3.4
  Top Layer w0.254: v1(18.29,9.65) 18.28,9.66 17.34,9.66
  Bottom Layer w0.254: U6.40 16.7,9.21 17.14,9.65 v1(18.29,9.65)
PB1: length 4.2
  Top Layer w0.254: 17.34,10.16 15.86,10.16 15.49,9.78 15.11,9.78 v1(14.6,10.29)
  Bottom Layer w0.254: U6.27 14.3,10.8 14.6,10.5 v1(14.6,10.29)
PB2: length 7
  Top Layer w0.254: v1(18.29,10.67) 18.28,10.66 17.34,10.66
  Bottom Layer w0.254: U6.25 13.92,11.24 13.92,10.21 14.49,9.65 15.5,9.65 15.76,9.91 16.38,9.91 17.02,10.54 18.16,10.54 v1(18.29,10.67)
PB3: length 3.9
  Top Layer w0.254: U4.39 9.75,11.66 10.67,10.74 v1(10.67,10.41)
  Bottom Layer w0.254: v1(10.67,10.41) 10.29,10.41 9.9,10.8 U6.5
PB4: length 4
  Top Layer w0.254: v1(7.62,11.43) 7.89,11.16 U4.40
  Bottom Layer w0.254: U6.3 9.5,11.81 9.38,11.94 8.13,11.94 v1(7.62,11.43)
PB5: length 3.6
  Top Layer w0.254: U4.41 8.83,10.67 v1(7.62,10.67)
  Bottom Layer w0.254: U6.1 9.1,10.63 8.76,10.29 8,10.29 v1(7.62,10.67)
PB6: length 3.2
  Top Layer w0.254: U4.42 10.04,10.16 v1(10.67,9.53)
  Bottom Layer w0.254: U6.8 10.3,8.98 10.67,9.34 v1(10.67,9.53)
PB7: length 2.1
  Top Layer w0.254: v1(9.91,9.53) 9.78,9.66 U4.43
  Bottom Layer w0.254: v1(9.91,9.53) 9.91,8.55 U6.6
PB8: length 5.7
  Top Layer w0.254: v1(7.24,8.76) 7.86,8.76 7.97,8.66 U4.45
  Bottom Layer w0.254: v1(7.24,8.76) 7.24,8 7.75,7.49 9.02,7.49 9.5,7.98 U6.4
PB9: length 2.9
  Top Layer w0.254: U4.46 8.82,8.13 v1(7.87,8.13)
  Bottom Layer w0.254: U6.2 9.1,8.09 8.89,7.87 8.13,7.87 v1(7.87,8.13)
PB10: length 4.2
  Top Layer w0.254: 17.34,11.16 16.11,11.16 v1(15.37,10.41)
  Bottom Layer w0.254: v1(15.37,10.41) 16.28,10.41 16.68,10.82 16.68,11.24 U6.39
PB11: length 4.3
  Top Layer w0.254: v1(18.54,12.06) 18.54,11.98 18.22,11.66 17.34,11.66
  Bottom Layer w0.254: v1(18.54,12.06) 16.55,12.06 16.3,11.81 U6.37
PB12: length 3.1
  Top Layer w0.254: v1(16.13,12.45) 16.13,13.87 U4.25
  Bottom Layer w0.254: U6.35 15.9,12.22 v1(16.13,12.45)
PB13: length 3
  Top Layer w0.254: 15.34,14.16 15.34,12.85 v1(15.49,12.7)
  Bottom Layer w0.254: U6.33 15.5,12.19 15.49,12.2 v1(15.49,12.7)
PB14: length 3
  Top Layer w0.254: v1(14.86,12.45) 14.86,13.26 14.84,13.28 U4.27
  Bottom Layer w0.254: v1(14.86,12.45) 14.86,12.19 15.12,11.93 15.12,11.28 U6.31
PB15: length 3.1
  Top Layer w0.254: v1(14.22,12.7) 14.34,12.82 14.34,14.16
  Bottom Layer w0.254: U6.29 14.7,11.84 14.22,12.32 v1(14.22,12.7)
PC13: length 17.7
  Top Layer w0.254: v1(17.02,6.48) 17.4,6.1 18.03,6.1 18.92,6.98 18.92,11.16 R5.2 ; v1(13.08,7.62) 11.93,7.62 10.84,6.53 U4.2
  Bottom Layer w0.254: v1(17.02,6.48) 16.64,6.1 14.6,6.1 v1(13.08,7.62) 13.1,7.64 U6.22
RES: length 13.7
  Top Layer w0.254: v1(13.08,6.86) 13.34,6.59 U4.7 ; RES.3 19.63,7.56 v1(19.56,7.49) 19.63,7.42 RES.4
  Bottom Layer w0.254: v1(19.56,7.49) 19.56,7.24 18.03,5.72 14.22,5.72 v1(13.08,6.86)
SWCLK: length 9.1
  Top Layer w0.254: ST_LINK.2 5.35,6.72 5.08,6.99 5.08,8.76 7.09,10.77 7.09,11.91 7.83,12.66 U4.37
SWDIO: length 16.3
  Top Layer w0.254: ST_LINK.3 5.35,5.47 4.7,6.12 4.7,8.76 4.72,8.79 4.72,8.91 6.73,10.92 6.73,12.06 8.51,13.84 9.53,13.84 9.78,14.1 9.78,15.24 10.03,15.49 10.79,15.49 11.34,14.95 U4.34
$1N3567: length 3.2
  Bottom Layer w0.381: v1(21.49,13.84) 21.49,13.56 21.97,13.08 21.97,12.07 v1(21.07,11.18)
$1N4136: length 3.3
  Bottom Layer w0.381: v1(21.48,15.24) 20.63,14.39 20.63,12.89 v1(21.07,12.45)

## Copper pours and planes (outline as drawn; the poured copper is in the pictures)
3.3V on Top Layer: 0.89,17.15 9.4,17.15 9.4,14.86 0.89,14.86
3.3V on Top Layer: 8.38,7.37 8.38,4.76 8.07,4.45 5.37,4.45 5.37,3.88 9.22,3.88 10.49,5.16 10.49,6.59 9.72,7.37
3.3V on Bottom Layer: 17.91,18.54 17.91,14.1 16.64,12.83 16.64,12.45 18.98,12.45 19.7,11.73 19.7,10.68 20.64,10.68 20.64,11.73 19.44,12.93 19.44,16.23 19.85,16.23 19.85,18.51 19.81,18.54
3.3V on Bottom Layer: 10.54,12.95 9,12.95 9,14.83 0.82,14.68 0.76,14.73 0.76,17.4 8.76,17.4 10.54,15.62
3.3V on Bottom Layer: 10.54,8.89 11.68,8.89 11.68,8.13 10.49,6.94 10.49,4.75 8.46,4.75 8.38,4.83 8.38,7.21 9.62,7.21 10.54,8.13
GND on Top Layer: -0.64,20.57 23.24,20.57 23.24,-0.13 -0.64,-0.13
GND on Bottom Layer: -0.13,20.57 23.75,20.57 23.75,-0.89 -0.13,-0.89

## Text on the board
Bottom Silkscreen Layer: 温柔_过了头
